# Altium project PCB_Project1.PrjPCB
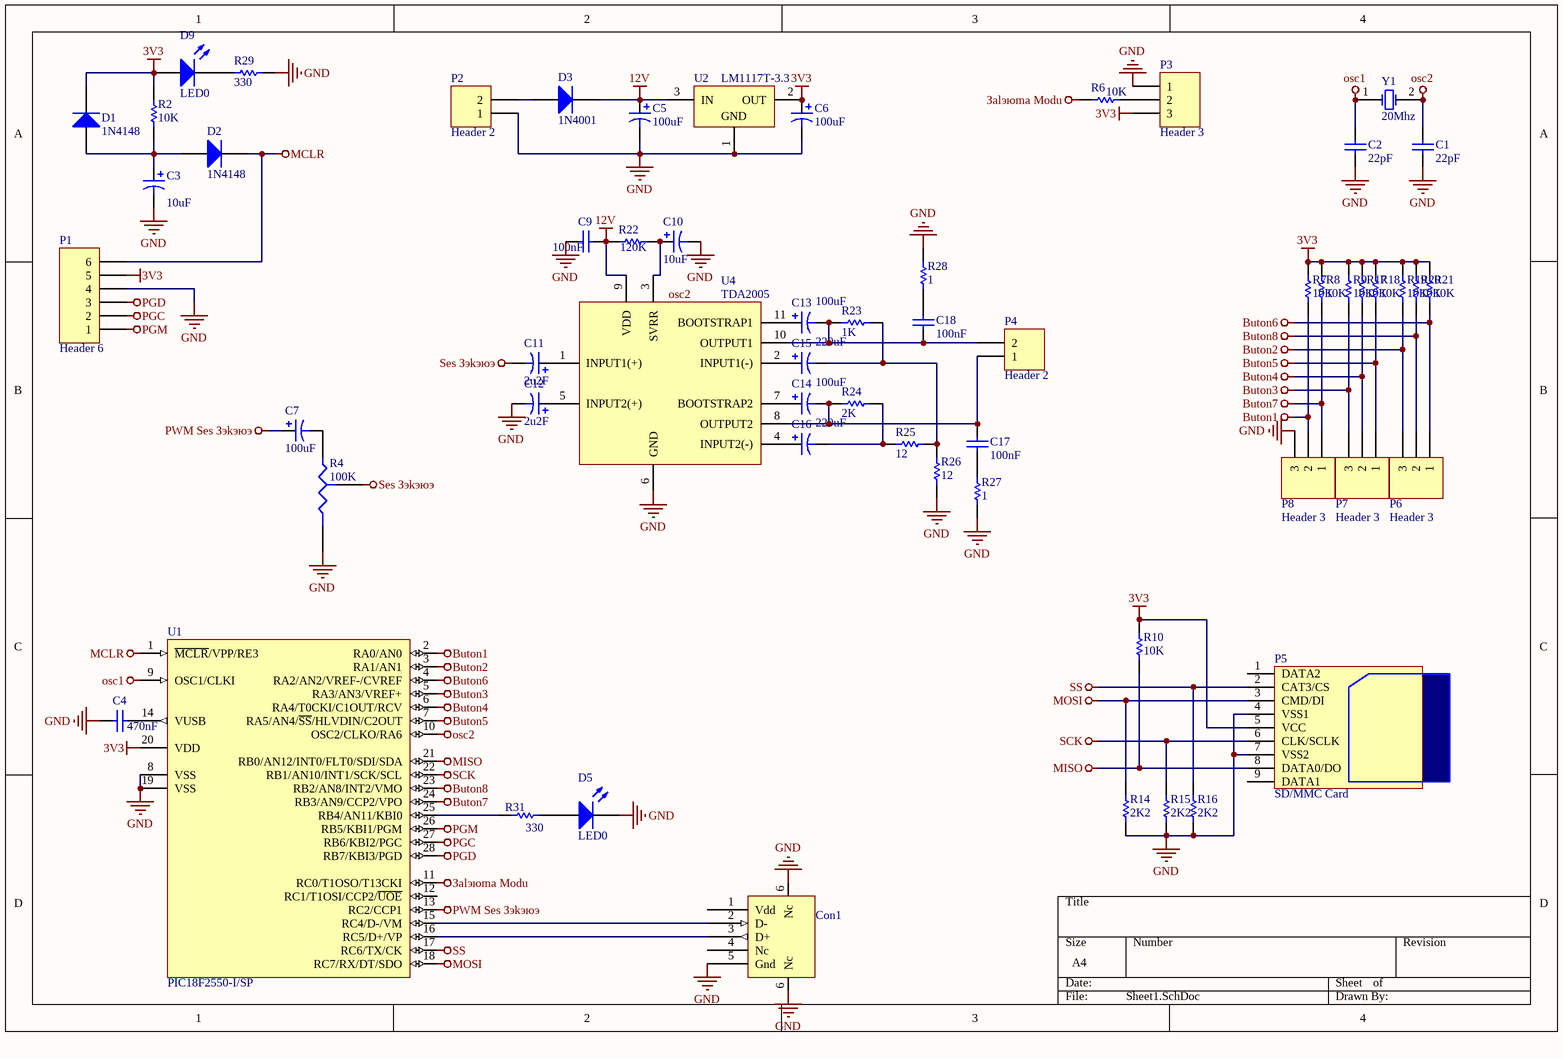
[diagram p0: Sheet1.SchDoc]
1 sheet, 59 parts. Net scope: global (net labels, ports and power ports of the same name join across sheets).
Board file: PCB1.PcbDoc

## Sheet Sheet1.SchDoc
size A4; PageSetup: Record=PageOptions|CenterHorizontal=True|CenterVertical=True|PrintScale=0.98|XCorrection=1.00|YCorrection=1.00|PrintKind=2|BorderSize=5000000|LeftOffset=0|BottomOffset=0|Orientation=2|PaperLength=1000|PaperWidth=1000|Scale=100|PaperSource=7|PrintQuality=-4|MediaType=1|DitherType=10|PaperKind=A4|PrintScaleMode=1

### Parts
C1  22pF  [R38]
C2  22pF  [R38]
C3  10uF  [CAP 5x11 - 2mm]
C4  470nF  [Cap 5mm]
C5  100uF  [Cap 8x11.5 - 3.5mm]
C6  100uF  [Cap 8x11.5 - 3.5mm]
C7  100uF  [Cap 8x11.5 - 3.5mm]
C9  100nF  [Cap 5mm]
C10  10uF  [CAP 5x11 - 2mm]
C11  2u2F  [CAP 5x11 - 2mm]
C12  2u2F  [CAP 5x11 - 2mm]
C13  100uF  [Cap 8x11.5 - 3.5mm]
C14  100uF  [Cap 8x11.5 - 3.5mm]
C15  220uF  [CAP 10x12.5 - 5mm]
C16  220uF  [CAP 10x12.5 - 5mm]
C17  100nF  [Cap 5mm]
C18  100nF  [Cap 5mm]
Con1  Usb mini B  [USB Mini B SMD]  (value not drawn)
D1  1N4148  [DO - 41]
D2  1N4148  [DO - 41]
D3  1N4001  [DO - 41]
D5  LED0  [Led 4mm]
D9  LED0  [Led 4mm]
P1  Header 6  [Header 6 way]
P2  Header 2  [Klemens 3P]
P3  Header 3  [HDR1X3]
P4  Header 2  [Klemens 3P]
P5  SD/MMC Card  [SD/MMC]
P6  Header 3  [Klemens 3P]
P7  Header 3  [Klemens 3P]
P8  Header 3  [Klemens 3P]
R2  10K  [Dip 0.3 inc]
R4  100K  [Trimpot dik]
R6  10K  [Dip 0.3 inc]
R7  10K  [Dip 0.3 inc]
R8  10K  [Dip 0.3 inc]
R9  10K  [Dip 0.3 inc]
R10  10K  [Dip 0.3 inc]
R14  2K2  [Dip 0.3 inc]
R15  2K2  [Dip 0.3 inc]
R16  2K2  [Dip 0.3 inc]
R17  10K  [Dip 0.3 inc]
R18  10K  [Dip 0.3 inc]
R19  10K  [Dip 0.3 inc]
R20  10K  [Dip 0.3 inc]
R21  10K  [Dip 0.3 inc]
R22  120K  [Dip 0.3 inc]
R23  1K  [Dip 0.3 inc]
R24  2K  [Dip 0.3 inc]
R25  12  [Dip 0.3 inc]
R26  12  [Dip 0.3 inc]
R27  1  [Dip 0.3 inc]
R28  1  [Dip 0.3 inc]
R29  330  [Dip 0.3 inc]
R31  330  [Dip 0.3 inc]
U1  PIC18F2550-I/SP  [SPDIP300-SP28]
U2  LM1117T-3.3  [T03B]
U4  TDA2005  [Multiwatt11]
Y1  20Mhz  [Kristal]

### Nets
3V3: C6.1 D1.2(K) D9.1(A) P1.5 P3.3 P5.5(VCC) R2.2 R7.1 R8.1 R9.1 R10.1 R17.1 R18.1 R19.1 R20.1 R21.1 U1.20(VDD) U2.2(OUT)
12V: C5.1 C9.2 D3.2(K) R22.2 U2.3(IN) U4.9(VDD)
Buton1: P8.2 R7.2 U1.2(RA0/AN0)
Buton2: P6.3 R19.2 U1.3(RA1/AN1)
Buton3: P7.3 R9.2 U1.5(RA3/AN3/VREF+)
Buton4: P7.2 R17.2 U1.6(RA4/T0CKI/C1OUT/RCV)
Buton5: P7.1 R18.2 U1.7(RA5/AN4/~{SS}/HLVDIN/C2OUT)
Buton6: P6.1 R21.2 U1.4(RA2/AN2/VREF-/CVREF)
Buton7: P8.1 R8.2 U1.24(RB3/AN9/CCP2/VPO)
Buton8: P6.2 R20.2 U1.23(RB2/AN8/INT2/VMO)
GND: C1.1 C2.1 C3.2 C4.1 C5.2 C6.2 C9.1 C10.2 C12.2 Con1.5(Gnd) Con1.6(Nc) D5.2(K) P1.4 P2.1 P3.1 P5.4(VSS1) P5.7(VSS2) P8.3 R4.2(B) R14.1 R15.1 R16.1 R26.1 R27.1 R28.1 R29.2 U1.8(VSS) U1.19(VSS) U2.1(GND) U4.6(GND)
MCLR: D2.2(K) P1.6 U1.1(~{MCLR}/VPP/RE3)
MISO: P5.8(DATA0/DO) R10.2 U1.21(RB0/AN12/INT0/FLT0/SDI/SDA)
MOSI: P5.3(CMD/DI) R14.2 U1.18(RC7/RX/DT/SDO)
osc1: C2.2 U1.9(OSC1/CLKI) Y1.1(OSC1)
osc2: C1.2 U1.10(OSC2/CLKO/RA6) Y1.2(OSC2)
PGC: P1.2 U1.27(RB6/KBI2/PGC)
PGD: P1.3 U1.28(RB7/KBI3/PGD)
PGM: P1.1 U1.26(RB5/KBI1/PGM)
PWM Ses Зэkэюэ: C7.1 U1.13(RC2/CCP1)
SCK: P5.6(CLK/SCLK) R15.2 U1.22(RB1/AN10/INT1/SCK/SCL)
Ses Зэkэюэ: C11.2 R4.3(TAP)
SS: P5.2(CAT3/CS) R16.2 U1.17(RC6/TX/CK)
Зalэюma Modu: R6.2 U1.11(RC0/T1OSO/T13CKI)
NetC3_1: C3.1 D1.1(A) D2.1(A) R2.1
NetC4_2: C4.2 U1.14(VUSB)
NetC7_2: C7.2 R4.1(A)
NetC10_1: C10.1 R22.1 U4.3(SVRR)
NetC11_1: C11.1 U4.1(INPUT1(+))
NetC12_1: C12.1 U4.5(INPUT2(+))
NetC13_1: C13.1 U4.11(BOOTSTRAP1)
NetC13_2: C13.2 C18.2 P4.2 R23.1 U4.10(OUTPUT1)
NetC14_1: C14.1 U4.7(BOOTSTRAP2)
NetC14_2: C14.2 C17.2 P4.1 R24.1 U4.8(OUTPUT2)
NetC15_1: C15.1 U4.2(INPUT1(-))
NetC15_2: C15.2 R23.2 R25.2 R26.2
NetC16_1: C16.1 U4.4(INPUT2(-))
NetC16_2: C16.2 R24.2 R25.1
NetC17_1: C17.1 R27.2
NetC18_1: C18.1 R28.2
NetCon1_2: Con1.2(D-) U1.15(RC4/D-/VM)
NetCon1_3: Con1.3(D+) U1.16(RC5/D+/VP)
NetD3_1: D3.1(A) P2.2
NetD5_1: D5.1(A) R31.1
NetD9_2: D9.2(K) R29.1
NetP3_2: P3.2 R6.1
NetR31_2: R31.2 U1.25(RB4/AN11/KBI0)

Not connected (* = marked no-connect by the designer): Con1 1(Vdd) 4(Nc); P5 1(DATA2) 9(DATA1); U1 12(RC1/T1OSI/CCP2/~{UOE})

### Notes on the sheet
- Labels drawn without touching a wire or pin: osc2

### Library data of the parts
C1 C2 C4 C9 C17 C18 = Cap: Capacitor; Published: 8-Jun-2000; LatestRevisionDate: 17-Jul-2002; LatestRevisionNote: Re-released for DXP Platform.; PackageReference: RAD-0.3; Publisher: Altium Limited
  C1 C2: PackageDescription: Radial Cap, Thru-Hole; 2 Leads; 0.3 in Pin Spacing; Value: 22pF
  C4: Value: 470nF
  C9 C17 C18: Value: 100nF
C3 C5-C7 C10-C16 = Cap Pol1: Polarized Capacitor (Radial); Published: 8-Jun-2000; LatestRevisionDate: 17-Jul-2002; LatestRevisionNote: Re-released for DXP Platform.; PackageReference: RB7.6-15; Publisher: Altium Limited
  C3 C10: Value: 10uF
  C5-C7 C13 C14: Value: 100uF
  C11 C12: Value: 2u2F
  C15 C16: Value: 220uF
D1 D2 = Diode 1N914: High Conductance Fast Diode; Published: 8-Jun-2000; LatestRevisionDate: 17-Jul-2002; LatestRevisionNote: Re-released for DXP Platform.; DatasheetVersion: 1997; PackageReference: DO-35; Publisher: Altium Limited; Code_JEDEC: DO-204-AH; ComponentLink1Description: Manufacturer Link; ComponentLink1URL: http://www.fairchildsemi.com/; ComponentLink2Description: Datasheet; ComponentLink2URL: http://www.fairchildsemi.com/ds/1N%2F1N4448.pdf
D3 = Diode: Default Diode; Published: 8-Jun-2000; LatestRevisionDate: 17-Jul-2002; LatestRevisionNote: Re-released for DXP Platform.; PackageVersion: Sep-1996; PackageReference: SMC; Publisher: Altium Limited; Code_JEDEC: DO-214-AB
D5 D9 = LED0: Typical INFRARED GaAs LED; Published: 8-Jun-2000; LatestRevisionDate: 08-Jul-2005; LatestRevisionNote: Mech Layer 1 removed.; PackageReference: LED-0; Publisher: Altium Limited; PackageDescription: LED; 2 Leads
P1 = Header 6: Header, 6-Pin; LatestRevisionDate: 17-Jul-2002; LatestRevisionNote: Re-released for DXP Platform.; Publisher: Altium Limited
P2 P4 = Header 2: Header, 2-Pin; pin to pad: 2>3; LatestRevisionDate: 17-Jul-2002; LatestRevisionNote: Re-released for DXP Platform.; Publisher: Altium Limited
P3 P6-P8 = Header 3: Header, 3-Pin; LatestRevisionDate: 17-Jul-2002; LatestRevisionNote: Re-released for DXP Platform.; Publisher: Altium Limited
P5 = MMC Kart
R2 R6-R10 R14-R29 R31 = Res1: Resistor; Published: 8-Jun-2000; LatestRevisionDate: 17-Jul-2002; LatestRevisionNote: Re-released for DXP Platform.; PackageReference: AXIAL-0.3; Publisher: Altium Limited
  R2 R6-R10 R17-R21: Value: 10K
  R14-R16: Value: 2K2
  R22: Value: 120K
  R23: Value: 1K
  R24: Value: 2K
  R25 R26: Value: 12
  R27 R28: Value: 1
  R29 R31: Value: 330
R4 = Res Tap: Tapped Resistor; pin to pad: 2>3 3>2; Sim Note: Enter the Resistance value and the set point into parameter fields.; Set Position: 0.5; Published: 24-Mar-1999; LatestRevisionDate: 17-Jul-2002; LatestRevisionNote: Re-released for DXP Platform.; PackageReference: VR3; Publisher: Altium Limited; Value: 100K
U1 = PIC18F2550-I/SP: High Performance, Enhanced Flash, USB Microcontroller with nanoWatt Technology, 32K Flash, 28-Pin SPDIP, Industrial Temperature Range; FirstPublished: 29-Jan-2009; LatestRevisionDate: 02-Dec-2009; LatestRevisionNote: Updated to datasheet revision E, Aug-2008; DatasheetVersion: revE, Aug-2008; PackageVersion: revBB, Aug-2009; PackageReference: SPDIP300-SP28; Publisher: Altium Limited; PackageDescription: 28-Lead Skinny Plastic Dual In-Line (SP) - 300 mil Body [SPDIP]; Supplier 1: Digi-Key; Supplier Part Number 1: PIC18F2550-I/SP-ND; Supplier 2: Farnell; Supplier Part Number 2: 1523822; Supplier 3: Farnell; Supplier Part Number 3: 9321250; Supplier 4: Newark; Supplier Part Number 4: 80K6054; ComponentLink1Description: Datasheet; ComponentLink1URL: http://ww1.microchip.com/downloads/en/DeviceDoc/39632e.pdf; ComponentLink2Description: Packaging Specification; ComponentLink2URL: http://www.microchip.com/stellent/groups/techpub_sg/documents/packagingspec/en012702.pdf; ComponentLink3Description: Microchip.com Home; ComponentLink3URL: http://www.microchip.com/
U2 = LM1117T-3.3: 800mA Low-Dropout Linear Regulator; Manufacturer: National Semiconductor; CompType: LDO IC; PackageTopMarking: NSUZXYTTE#*LM1117T*3.3; PowerWise: N; Published: 4-Dec-2008; DatasheetVersion: Apr-2006; PackageVersion: revL, Jan-1992; PackageReference: T03B; Publisher: Altium Limited; PackageDescription: TO-220, Molded, 3 Lead, Straight; PartNumber: LM1117T-3.3; RoHS: O; PinCount: 3; DigiKeyPartNumber: LM1117T-3.3-ND; ComponentLink1Description: LM1117 Datasheet; ComponentLink1URL: http://www.national.com/ds/LM/LM1117.pdf; ComponentLink2Description: LM1117 Web Page; ComponentLink2URL: http://www.national.com/pf/LM/LM1117.html; ComponentLink3Description: T03B Package Page; ComponentLink3URL: http://www.national.com/packaging/folders/t03b.html
Y1 = XTAL: Crystal Oscillator; Published: 8-Jun-2000; LatestRevisionDate: 17-Jul-2002; LatestRevisionNote: Re-released for DXP Platform.; PackageReference: R38; Publisher: Altium Limited; PackageDescription: Crystal, Thru-Hole; 2 Leads; Body 3.1 x 8.2 mm (Dia.xH)